# EAGLE design BOARD1A (EAGLE 7.4.0)
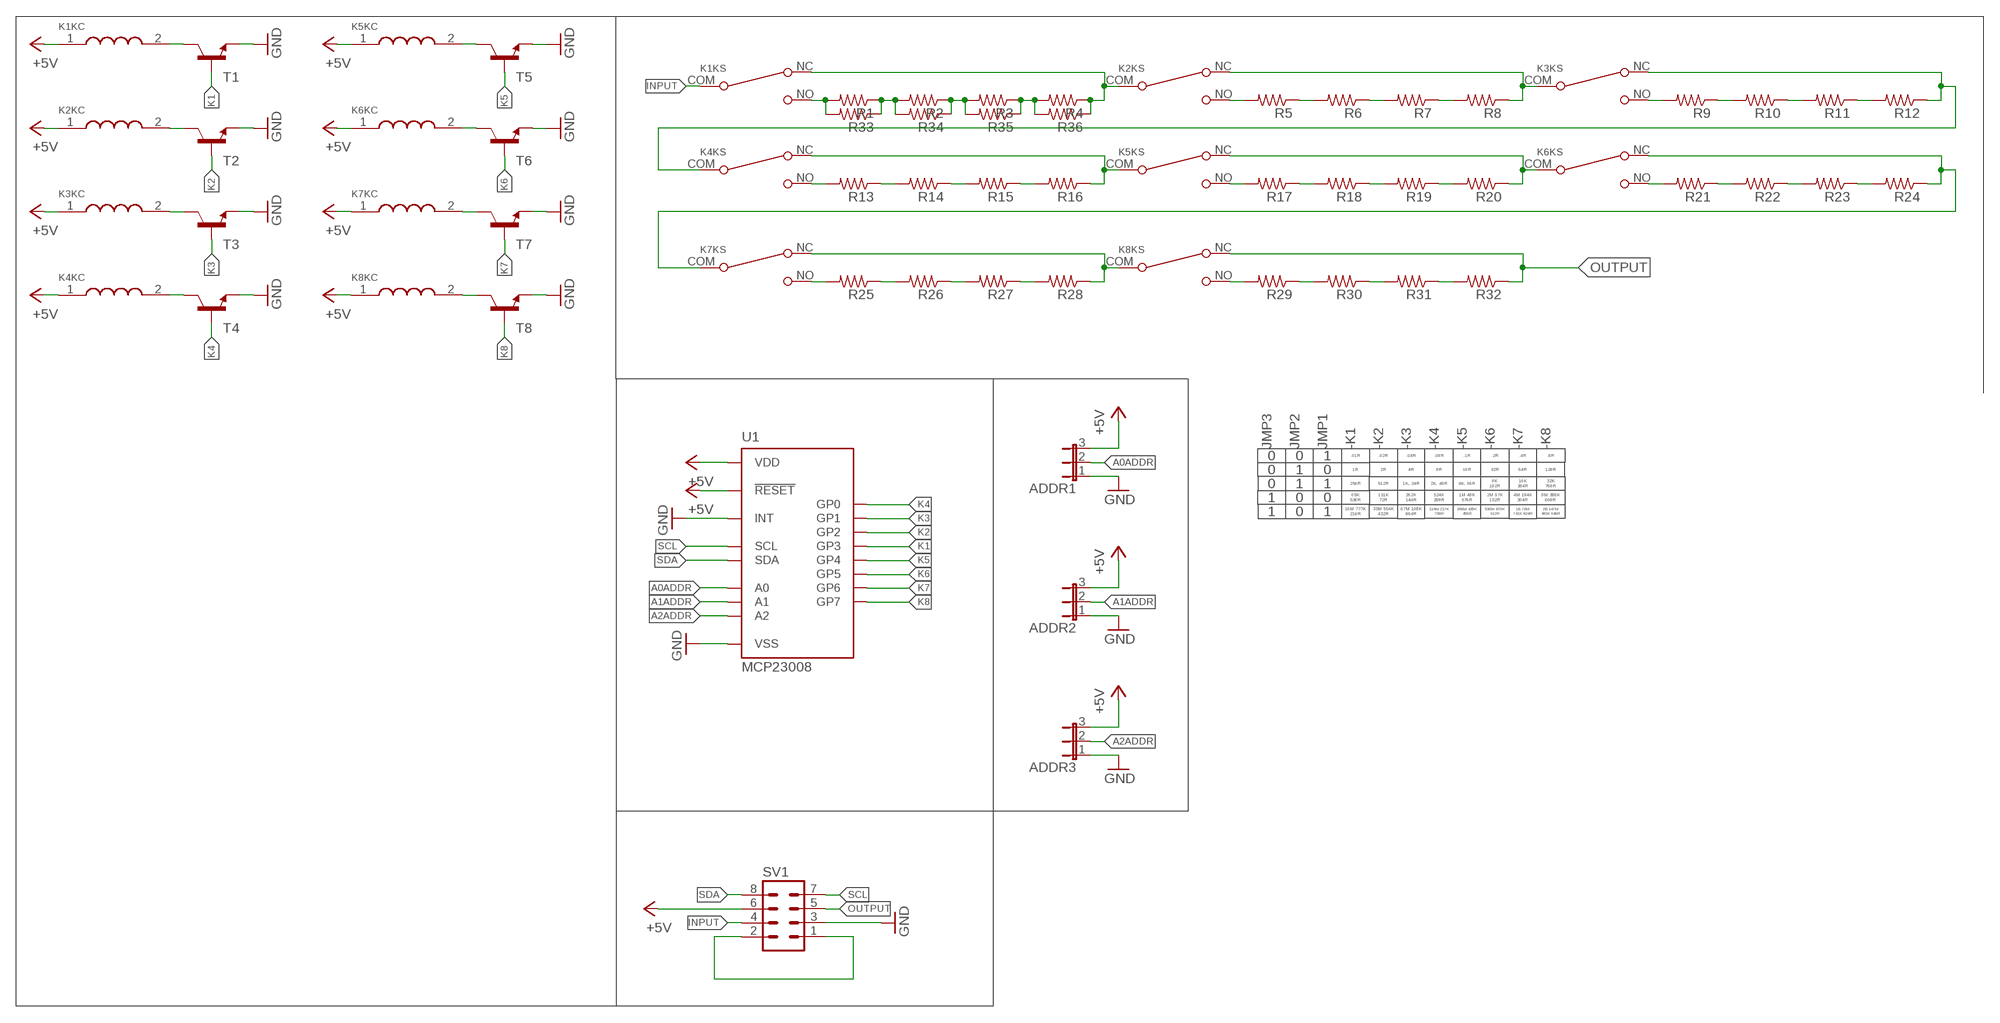
[diagram p0: schematic, sheet 1]

## Parts
ADDR1  JP2E  [JP2]
ADDR2  JP2E  [JP2]
ADDR3  JP2E  [JP2]
K1  G5LE-1-VD DC12  G5LE  [G5LE]
K2  G5LE  [G5LE]
K3  G5LE  [G5LE]
K4  G5LE  [G5LE]
K5  G5LE  [G5LE]
K6  G5LE  [G5LE]
K7  G5LE  [G5LE]
K8  G5LE  [G5LE]
R1  R-US_0207/12  [0207/12]
R2  R-US_0207/12  [0207/12]
R3  R-US_0207/12  [0207/12]
R4  R-US_0207/12  [0207/12]
R5  R-US_0207/12  [0207/12]
R6  R-US_0207/12  [0207/12]
R7  R-US_0207/12  [0207/12]
R8  R-US_0207/12  [0207/12]
R9  R-US_0207/12  [0207/12]
R10  R-US_0207/12  [0207/12]
R11  R-US_0207/12  [0207/12]
R12  R-US_0207/12  [0207/12]
R13  R-US_0207/12  [0207/12]
R14  R-US_0207/12  [0207/12]
R15  R-US_0207/12  [0207/12]
R16  R-US_0207/12  [0207/12]
R17  R-US_0207/12  [0207/12]
R18  R-US_0207/12  [0207/12]
R19  R-US_0207/12  [0207/12]
R20  R-US_0207/12  [0207/12]
R21  R-US_0207/12  [0207/12]
R22  R-US_0207/12  [0207/12]
R23  R-US_0207/12  [0207/12]
R24  R-US_0207/12  [0207/12]
R25  R-US_0207/12  [0207/12]
R26  R-US_0207/12  [0207/12]
R27  R-US_0207/12  [0207/12]
R28  R-US_0207/12  [0207/12]
R29  R-US_0207/12  [0207/12]
R30  R-US_0207/12  [0207/12]
R31  R-US_0207/12  [0207/12]
R32  R-US_0207/12  [0207/12]
R33  RESISTOR1206  [1206]
R34  RESISTOR1206  [1206]
R35  RESISTOR1206  [1206]
R36  RESISTOR1206  [1206]
SV1  MA04-2  [MA04-2]
T1  MMUN2211LT1-NPN-SC59-BEC  [SC59-BEC]
T2  MMUN2211LT1-NPN-SC59-BEC  [SC59-BEC]
T3  MMUN2211LT1-NPN-SC59-BEC  [SC59-BEC]
T4  MMUN2211LT1-NPN-SC59-BEC  [SC59-BEC]
T5  MMUN2211LT1-NPN-SC59-BEC  [SC59-BEC]
T6  MMUN2211LT1-NPN-SC59-BEC  [SC59-BEC]
T7  MMUN2211LT1-NPN-SC59-BEC  [SC59-BEC]
T8  MMUN2211LT1-NPN-SC59-BEC  [SC59-BEC]
U1  MCP23008  [SOIC]

## Nets
+5V: ADDR1.3 ADDR2.3 ADDR3.3 K1.1(KC:COILA) K2.1(KC:COILA) K3.1(KC:COILA) K4.1(KC:COILA) K5.1(KC:COILA) K6.1(KC:COILA) K7.1(KC:COILA) K8.1(KC:COILA) SV1.6 U1.P$6(!RESET) U1.P$18(VDD)
A0ADDR: ADDR1.2 U1.P$5(A0)
A1ADDR: ADDR2.2 U1.P$4(A1)
A2ADDR: ADDR3.2 U1.P$3(A2)
GND: ADDR1.1 ADDR2.1 ADDR3.1 SV1.3 T1.E T2.E T3.E T4.E T5.E T6.E T7.E T8.E U1.P$8(INT) U1.P$9(VSS)
INPUT: K1.COM(KS:P$COM) SV1.4
K1: T1.B U1.P$13(GP3)
K2: T2.B U1.P$12(GP2)
K3: T3.B U1.P$11(GP1)
K4: T4.B U1.P$10(GP0)
K5: T5.B U1.P$14(GP4)
K6: T6.B U1.P$15(GP5)
K7: T7.B U1.P$16(GP6)
K8: T8.B U1.P$17(GP7)
N$1: K1.NO(KS:P$NO) R1.2 R33.2
N$2: R1.1 R2.2 R33.1 R34.2
N$3: R2.1 R3.2 R34.1 R35.2
N$4: R3.1 R4.2 R35.1 R36.2
N$5: SV1.1 SV1.2
N$6: K1.NC(KS:P$NC) K2.COM(KS:P$COM) R4.1 R36.1
N$7: K2.NO(KS:P$NO) R5.2
N$8: R6.1 R7.2
N$9: R5.1 R6.2
N$10: R7.1 R8.2
N$11: K3.2(KC:COILB) T3.C
N$12: K2.NC(KS:P$NC) K3.COM(KS:P$COM) R8.1
N$13: K1.2(KC:COILB) T1.C
N$14: K3.NO(KS:P$NO) R9.2
N$15: K2.2(KC:COILB) T2.C
N$16: R9.1 R10.2
N$17: K4.2(KC:COILB) T4.C
N$18: R10.1 R11.2
N$19: K5.2(KC:COILB) T5.C
N$20: R11.1 R12.2
N$21: K6.2(KC:COILB) T6.C
N$22: K3.NC(KS:P$NC) K4.COM(KS:P$COM) R12.1
N$23: K8.2(KC:COILB) T8.C
N$24: K4.NO(KS:P$NO) R13.2
N$25: K7.2(KC:COILB) T7.C
N$26: R13.1 R14.2
N$27: R14.1 R15.2
N$28: R15.1 R16.2
N$29: K4.NC(KS:P$NC) K5.COM(KS:P$COM) R16.1
N$30: K5.NO(KS:P$NO) R17.2
N$31: R17.1 R18.2
N$32: R18.1 R19.2
N$33: R19.1 R20.2
N$34: K5.NC(KS:P$NC) K6.COM(KS:P$COM) R20.1
N$35: K6.NO(KS:P$NO) R21.2
N$36: R21.1 R22.2
N$37: R22.1 R23.2
N$38: R23.1 R24.2
N$39: K6.NC(KS:P$NC) K7.COM(KS:P$COM) R24.1
N$40: K7.NO(KS:P$NO) R25.2
N$41: R25.1 R26.2
N$42: R26.1 R27.2
N$43: R27.1 R28.2
N$44: K7.NC(KS:P$NC) K8.COM(KS:P$COM) R28.1
N$45: K8.NO(KS:P$NO) R29.2
N$46: R29.1 R30.2
N$47: R30.1 R31.2
N$48: R31.1 R32.2
OUTPUT: K8.NC(KS:P$NC) R32.1 SV1.5
SCL: SV1.7 U1.P$1(SCL)
SDA: SV1.8 U1.P$2(SDA)

## Notes on the sheet
- JMP3 | JMP2 | JMP1 | -K1 | -K2 | -K3 | -K4 | -K5 | -K6 | -K7 | -K8
- 0 | 0 | 1 | .01R | .02R | .04R | .08R | .1R | .2R | .4R | .8R
- 0 | 1 | 0 | 1R | 2R | 4R | 8R | 16R | 32R | 64R | 128R
- 0 | 1 | 1 | 256R | 512R | 1K, 24R | 2K, 48R | 4K, 96R
- 8K
  192R
- 16K
  384R
- 32K
  768R
- 1 | 0 | 0
- 65K
  536R
- 131K
  72R
- 262K
  144R
- 524K
  288R
- 1M 48K
  576R
- 2M 97K
  152R
- 4M 194K
  304R
- 8M 388K
  608R
- 1 | 0 | 1
- 16M 777K
  216R
- 33M 554K
  432R
- 67M 108K
  864R
- 134M 217K
  728R
- 268M 435K
  456R
- 536M 870K
  912R
- 1B 73M
  741K 824R
- 2B 147M
  483K 648R

## Library data of the parts
ADDR1-ADDR3 = jumper:JP2E: JUMPER
K1-K8 = Jeremy:G5LE; G5LE: -1
R1-R32 = resistor:R-US_: RESISTOR, American symbol
R33-R36 = SparkFun:RESISTOR: Resistor Basic schematic elements and footprints for 0603, 1206, and PTH resistors.
SV1 = con-lstb:MA04-2: PIN HEADER; OC_FARNELL: unknown; OC_NEWARK: unknown
T1-T8 = transistor-neu-to92:*-NPN-: NPN Transistror
U1 = Jeremy:MCP23008: MCP23008 8-Bit I/O Expander I2C Interface ADDR: S0100XXX

## Net classes
0 default: clearance 0.205 mm

## Board
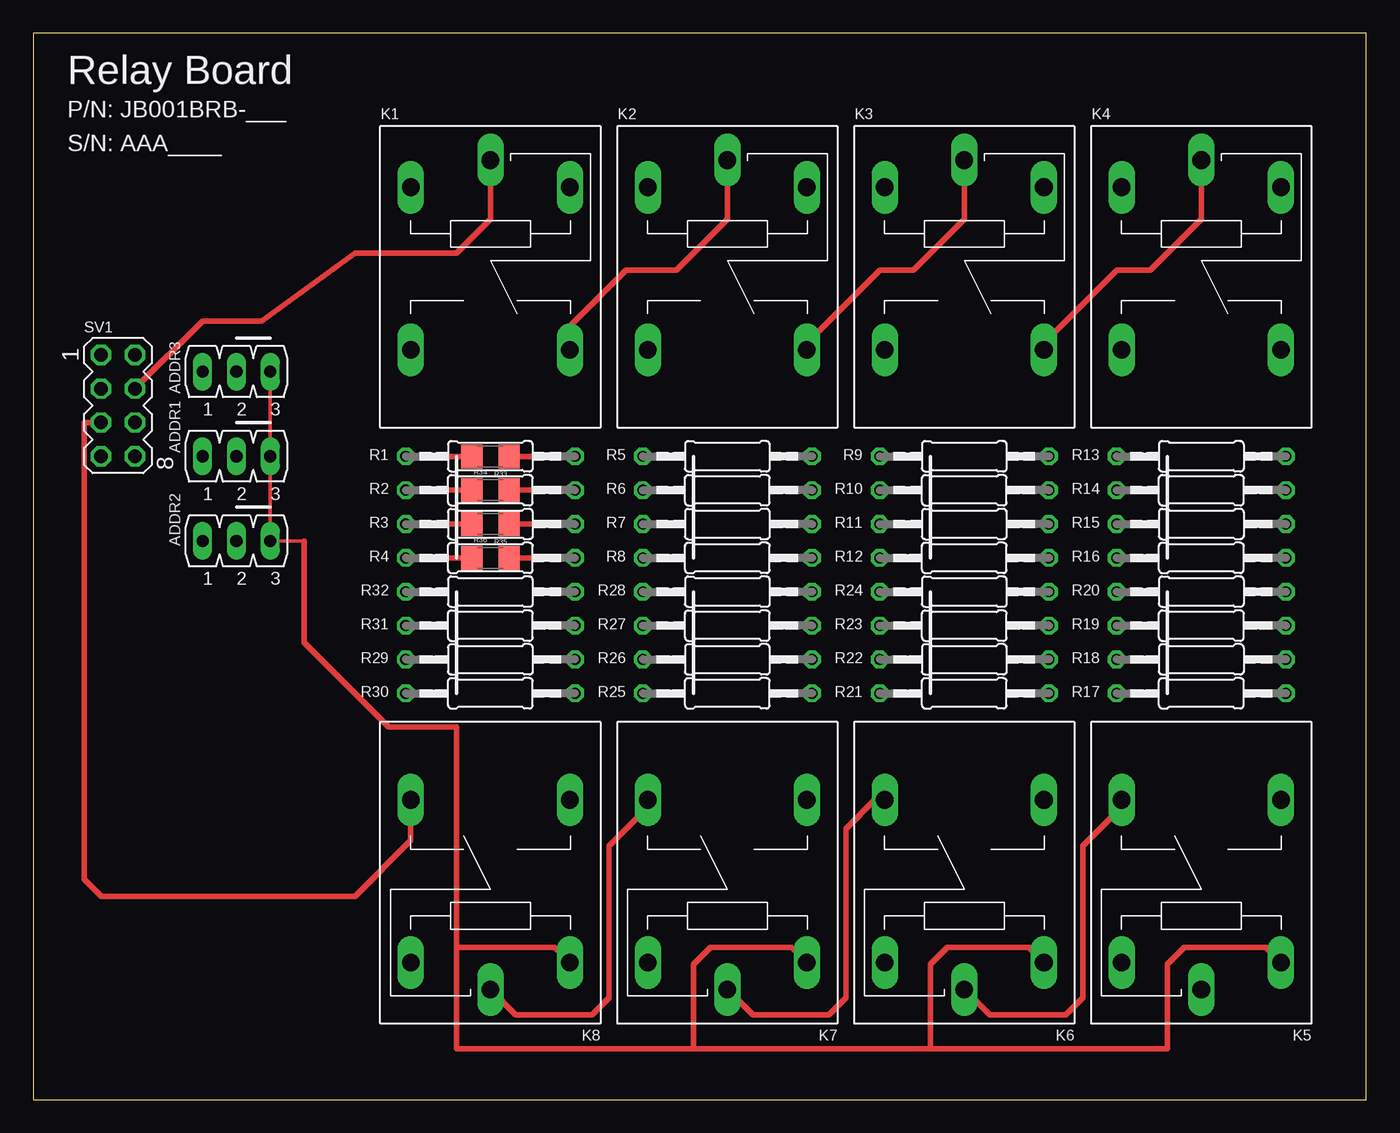
[diagram p1: board, top side]
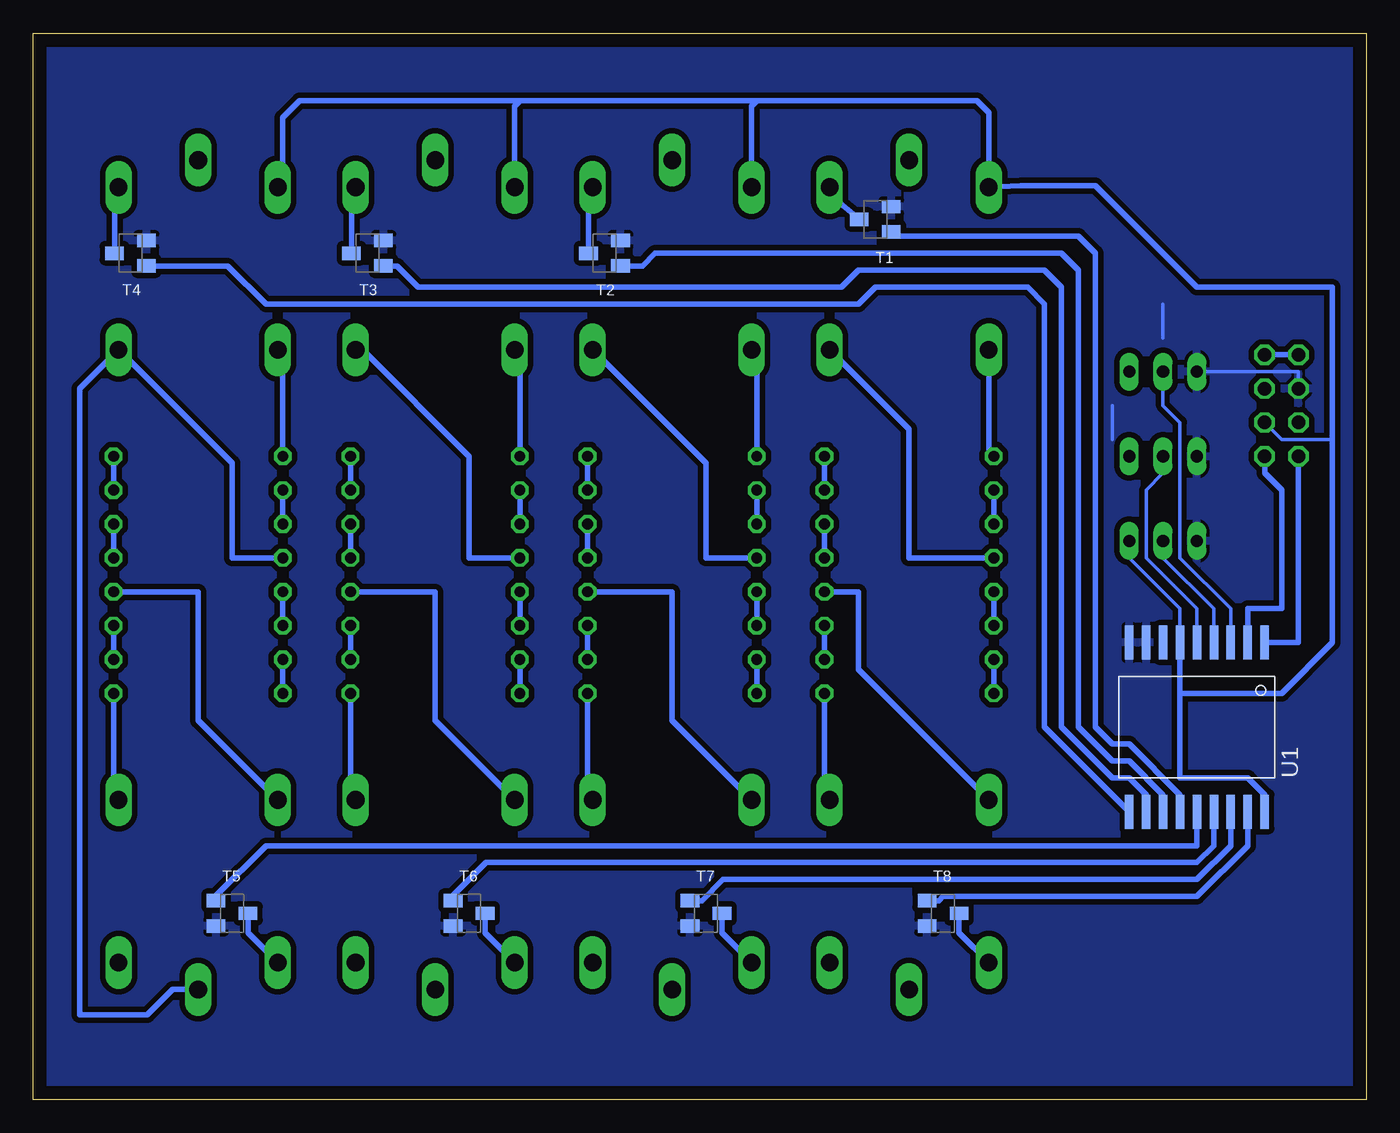
[diagram p2: board, bottom side, seen from below]

Size 100 x 80 mm. Coordinates in mm from the lower left corner, seen from the top.
Outline: 0,0 100,0 100,80 0,80 0,0
Copper layers (1*16): Top 0.035mm / dielectric 1.5mm / Bottom 0.035mm
Design rules "default": minimum track width 10mil, minimum drill 24mil, track to track 8mil, track to pad 8mil, pad to pad 8mil, via to via 8mil, smd to smd 8mil, copper to edge 40mil, drill to drill 8mil, minimum pad ring 10mil, minimum via ring 8mil, stop-mask expansion 4mil, vias tented up to drill 0mil, thermal gap 10mil

### Footprints (pad centres in the part's own frame; a part is rotated, then mirrored left to right if it is on the bottom)
JP2 = drill 0.914 long: 1 -2.54,0; 2 0,0; 3 2.54,0
G5LE = drill 1.321 long: 1 -7.493,-5.969; 2 -7.493,5.969; COM -9.525,0; NC 4.699,5.969; NO 4.699,-5.969
0207/12 = drill 0.813 octagon: 1 -6.35,0; 2 6.35,0
1206 = smd 1.6 x 1.8: 1 -1.4,0; 2 1.4,0
MA04-2 = drill 1.016 octagon: 1 -3.81,-1.27; 2 -3.81,1.27; 3 -1.27,-1.27; 4 -1.27,1.27; 5 1.27,-1.27; 6 1.27,1.27; 7 3.81,-1.27; 8 3.81,1.27
SC59-BEC = smd 1 x 1.4: B -0.95,-1.2; C 0,1.2; E 0.95,-1.2
SOIC = smd 2.54 x 0.635: P$1 6.35,-5.08; P$2 6.35,-3.81; P$3 6.35,-2.54; P$4 6.35,-1.27; P$5 6.35,0; P$6 6.35,1.27; P$7 6.35,2.54; P$8 6.35,3.81; P$9 6.35,5.08; P$10 -6.35,5.08; P$11 -6.35,3.81; P$12 -6.35,2.54; P$13 -6.35,1.27; P$14 -6.35,0; P$15 -6.35,-1.27; P$16 -6.35,-2.54; P$17 -6.35,-3.81; P$18 -6.35,-5.08

### Placement (x,y rotation side)
ADDR1  15.24,48.26 0 top
ADDR2  15.24,41.91 0 top
ADDR3  15.24,54.61 0 top
K1  34.29,60.96 270 top
K2  52.07,60.96 270 top
K3  69.85,60.96 270 top
K4  87.63,60.96 270 top
K5  87.63,17.78 90 top
K6  69.85,17.78 90 top
K7  52.07,17.78 90 top
K8  34.29,17.78 90 top
R1  34.29,48.26 180 top
R2  34.29,45.72 0 top
R3  34.29,43.18 180 top
R4  34.29,40.64 0 top
R5  52.07,48.26 180 top
R6  52.07,45.72 0 top
R7  52.07,43.18 180 top
R8  52.07,40.64 0 top
R9  69.85,48.26 180 top
R10  69.85,45.72 0 top
R11  69.85,43.18 180 top
R12  69.85,40.64 0 top
R13  87.63,48.26 180 top
R14  87.63,45.72 0 top
R15  87.63,43.18 180 top
R16  87.63,40.64 0 top
R17  87.63,30.48 0 top
R18  87.63,33.02 180 top
R19  87.63,35.56 0 top
R20  87.63,38.1 180 top
R21  69.85,30.48 0 top
R22  69.85,33.02 180 top
R23  69.85,35.56 0 top
R24  69.85,38.1 180 top
R25  52.07,30.48 0 top
R26  52.07,33.02 180 top
R27  52.07,35.56 0 top
R28  52.07,38.1 180 top
R29  34.29,30.48 0 top
R30  34.29,33.02 180 top
R31  34.29,35.56 0 top
R32  34.29,38.1 180 top
R33  34.29,48.26 180 top
R34  34.29,45.72 0 top
R35  34.29,43.18 180 top
R36  34.29,40.64 0 top
SV1  6.35,52.07 270 top
T1  36.83,66.04 90 bottom
T2  57.15,63.5 90 bottom
T3  74.93,63.5 90 bottom
T4  92.71,63.5 90 bottom
T5  85.09,13.97 270 bottom
T6  67.31,13.97 270 bottom
T7  49.53,13.97 270 bottom
T8  31.75,13.97 270 bottom
U1  12.7,27.94 90 bottom

### Tracks (layer width: path | path; a pad name or v marks a point on that pad's centre or on a via)
+5V
  Top 0.254: 20.32,41.91 ADDR2.3 | ADDR2.3 ADDR3.3 | ADDR2.3 ADDR1.3
  Top 0.406: K8.1 39.12,11.43 31.75,11.43 | 31.75,11.43 31.75,3.81 49.53,3.81 | K7.1 56.9,11.43 50.8,11.43 49.53,10.16 49.53,3.81 | K6.1 74.68,11.43 68.58,11.43 67.31,10.16 67.31,3.81 | K5.1 92.46,11.43 86.36,11.43 85.09,10.16 85.09,3.81 67.31,3.81 | 67.31,3.81 49.53,3.81 | 31.75,11.43 31.75,27.94 26.67,27.94 20.32,34.29 20.32,41.91
  Bottom 0.254: SV1.6 6.35,49.53 2.54,49.53 | U1.P$6 13.97,36.83 17.78,40.64 ADDR2.3
  Bottom 0.406: 45.72,74.93 29.21,74.93 28.32,74.04 K1.1 25.91,68.58 20.32,68.58 12.7,60.96 2.54,60.96 2.54,49.53 2.54,34.29 6.35,30.48 13.97,30.48 | 45.72,74.93 63.5,74.93 | 63.5,74.93 80.01,74.93 81.28,73.66 81.28,68.83 K4.1 | K3.1 63.88,74.55 63.5,74.93 | K2.1 46.1,74.55 45.72,74.93 | U1.P$18 7.62,22.86 8.89,24.13 13.97,24.13 13.97,30.48 | U1.P$6 13.97,30.48
A0ADDR
  Bottom 0.254: U1.P$5 12.7,36.83 16.51,40.64 16.51,45.72 15.24,46.99 ADDR1.2
A1ADDR
  Bottom 0.254: U1.P$4 11.43,36.83 15.24,40.64 ADDR2.2
A2ADDR
  Bottom 0.254: U1.P$3 10.16,36.83 13.97,40.64 13.97,50.8 15.24,52.07 ADDR3.2
GND
  Bottom 0.254: 15.24,57.15 15.24,59.69 | 19.05,52.07 19.05,49.53 | SV1.3 5.08,54.61 ADDR3.1
  pour Bottom (isolate 0.406): 0,80.01 0,0 100.33,0 100.33,80.01
INPUT
  Top 0.406: SV1.4 12.7,58.42 17.14,58.42 24.13,63.5 31.75,63.5 34.29,66.04 K1.COM
K1
  Bottom 0.406: T1.B 35.31,64.77 21.59,64.77 20.32,63.5 20.32,27.94 19.05,26.67 17.78,26.67 13.97,22.86 U1.P$13
K2
  Bottom 0.406: T2.B 54.29,62.55 53.34,63.5 22.86,63.5 21.59,62.23 21.59,27.94 19.05,25.4 17.78,25.4 15.24,22.86 U1.P$12
K3
  Bottom 0.406: T3.B 72.71,62.55 71.12,60.96 39.37,60.96 38.1,62.23 24.13,62.23 22.86,60.96 22.86,27.94 19.05,24.13 17.78,24.13 16.51,22.86 U1.P$11
K4
  Bottom 0.406: T4.B 85.41,62.55 82.55,59.69 38.1,59.69 36.83,60.96 25.4,60.96 24.13,59.69 24.13,27.94 U1.P$10
K5
  Bottom 0.406: T5.B 86.29,15.31 82.55,19.05 12.7,19.05 U1.P$14
K6
  Bottom 0.406: T6.B 68.51,15.31 66.04,17.78 12.7,17.78 11.43,19.05 U1.P$15
K7
  Bottom 0.406: T7.B 49.85,14.92 48.26,16.51 12.7,16.51 10.16,19.05 U1.P$16
K8
  Bottom 0.406: T8.B 32.07,14.92 31.75,15.24 12.7,15.24 8.89,19.05 U1.P$17
N$1
  Top 0.406: R1.2 R33.2
  Bottom 0.406: K1.NO 28.32,48.64 R1.2
N$2
  Top 0.406: R33.1 R1.1 | R34.2 R2.2
  Bottom 0.406: R1.1 R2.2
N$3
  Top 0.406: R34.1 R2.1 | R35.2 R3.2
  Bottom 0.406: R2.1 R3.2
N$4
  Top 0.406: R35.1 R3.1 | R36.2 R4.2
  Bottom 0.406: R3.1 R4.2
N$5
  Bottom 0.406: SV1.1 SV1.2
N$6
  Top 0.406: K1.NC 40.26,58.04 44.45,62.23 48.26,62.23 52.07,66.04 K2.COM | R36.1 R4.1
  Bottom 0.406: R4.1 34.29,40.64 34.29,50.29 K1.NC
N$7
  Bottom 0.406: R5.2 45.72,55.88 K2.NO
N$8
  Bottom 0.406: R6.1 R7.2
N$9
  Bottom 0.406: R5.1 R6.2
N$10
  Bottom 0.406: R7.1 R8.2
N$11
  Bottom 0.406: T3.C 76.13,68.14 K3.2
N$12
  Top 0.406: K2.NC 58.04,56.77 63.5,62.23 66.04,62.23 69.85,66.04 K3.COM
  Bottom 0.406: K2.NC 49.53,47.75 49.53,40.64 R8.1
N$13
  Bottom 0.406: T1.C 40.57,68.14 K1.2
N$14
  Bottom 0.406: R9.2 63.5,55.88 K3.NO
N$15
  Bottom 0.406: T2.C 58.35,68.14 K2.2
N$16
  Bottom 0.406: R9.1 R10.2
N$17
  Bottom 0.406: T4.C 93.91,68.14 K4.2
N$18
  Bottom 0.406: R10.1 R11.2
N$19
  Bottom 0.406: T5.C 83.89,12.52 K5.2
N$20
  Bottom 0.406: R11.1 R12.2
N$21
  Bottom 0.406: T6.C 66.11,12.52 K6.2
N$22
  Top 0.406: K3.NC 75.82,56.77 81.28,62.23 83.82,62.23 87.63,66.04 K4.COM
  Bottom 0.406: K3.NC 75.31,56.26 67.31,48.26 67.31,40.64 R12.1
N$23
  Bottom 0.406: T8.C 30.55,12.52 K8.2
N$24
  Bottom 0.406: R13.2 81.28,55.88 K4.NO
N$25
  Bottom 0.406: T7.C 48.33,12.52 K7.2
N$26
  Bottom 0.406: R13.1 R14.2
N$27
  Bottom 0.406: R14.1 R15.2
N$28
  Bottom 0.406: R15.1 R16.2
N$29
  Bottom 0.406: R16.1 85.09,40.64 85.09,47.75 K4.NC 96.52,53.34 96.52,6.35 91.44,6.35 89.53,8.26 K5.COM
N$30
  Bottom 0.406: R17.2 93.98,22.86 K5.NO
N$31
  Bottom 0.406: R18.2 R17.1
N$32
  Bottom 0.406: R19.2 R18.1
N$33
  Bottom 0.406: R20.2 R19.1
N$34
  Top 0.406: K5.NC 81.66,21.97 78.74,19.05 78.74,7.62 77.47,6.35 71.75,6.35 K6.COM
  Bottom 0.406: R20.1 87.63,38.1 87.63,28.45 K5.NC
N$35
  Bottom 0.406: R21.2 76.2,22.86 K6.NO
N$36
  Bottom 0.406: R22.2 R21.1
N$37
  Bottom 0.406: R23.2 R22.1
N$38
  Bottom 0.406: R24.2 R23.1
N$39
  Top 0.406: K6.NC 63.12,22.48 60.96,20.32 60.96,7.62 59.69,6.35 53.98,6.35 K7.COM
  Bottom 0.406: R24.1 69.85,38.1 69.85,28.45 K6.NC
N$40
  Bottom 0.406: R25.2 58.42,22.86 K7.NO
N$41
  Bottom 0.406: R26.2 R25.1
N$42
  Bottom 0.406: R26.1 R27.2
N$43
  Bottom 0.406: R28.2 R27.1
N$44
  Top 0.406: K7.NC 46.1,21.97 43.18,19.05 43.18,7.62 41.91,6.35 36.2,6.35 K8.COM
  Bottom 0.406: R28.1 52.07,38.1 52.07,28.45 K7.NC
N$45
  Bottom 0.406: R29.2 40.64,22.86 K8.NO
N$46
  Bottom 0.406: R30.2 R29.1
N$47
  Bottom 0.406: R30.1 R31.2
N$48
  Bottom 0.406: R31.1 R32.2
OUTPUT
  Top 0.406: SV1.5 3.81,50.8 3.81,16.51 5.08,15.24 24.13,15.24 28.32,19.43 K8.NC
  Bottom 0.406: K8.NC 38.1,32.26 38.1,38.1 R32.1
SCL
  Bottom 0.406: SV1.7 5.08,34.29 U1.P$1
SDA
  Bottom 0.406: U1.P$2 8.89,36.83 6.35,36.83 6.35,45.72 7.62,46.99 SV1.8

### Text on the board
_tsilk: Relay Board | P/N: JB001BRB-___ | S/N: AAA____